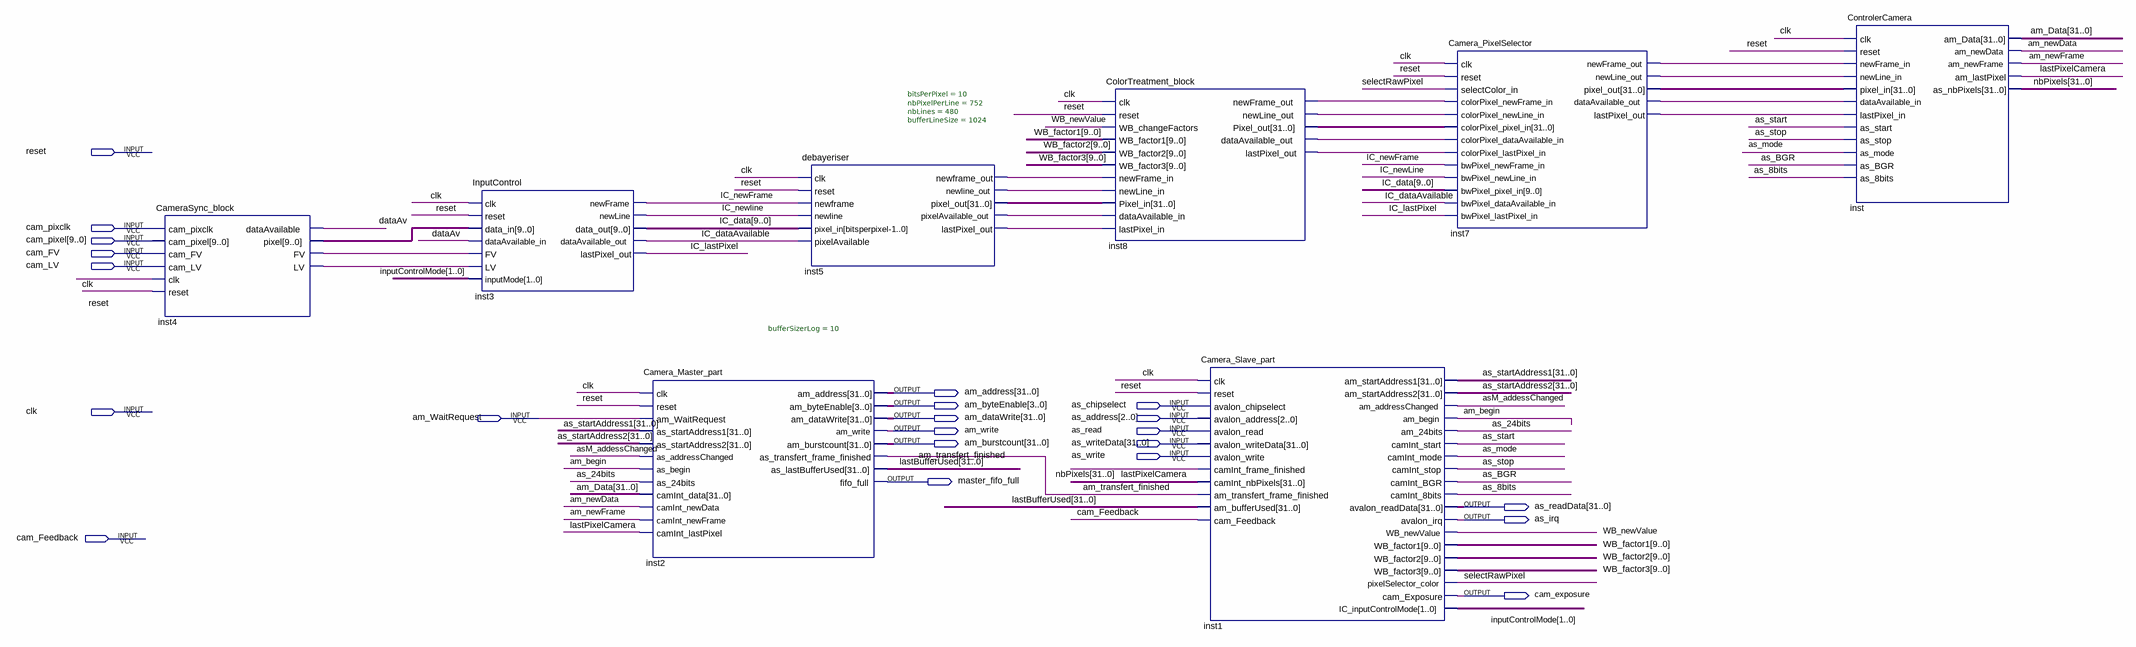
[diagram p0: schematic sheet]
// Quartus schematic Camera_Interface_block.bdf as structural Verilog: 8 symbols, 22 pins
module Camera_Interface_block (
  input  reset,
  input  cam_pixclk,
  input  [9:0] cam_pixel,
  input  cam_FV,
  input  cam_LV,
  input  as_chipselect,
  input  clk,
  input  am_WaitRequest,
  input  [2:0] as_address,
  input  as_read,
  input  [31:0] as_writeData,
  input  as_write,
  input  cam_Feedback,
  output [31:0] am_address,
  output [3:0] am_byteEnable,
  output [31:0] am_dataWrite,
  output am_write,
  output [31:0] am_burstcount,
  output master_fifo_full,
  output [31:0] as_readData,
  output as_irq,
  output cam_exposure
);

  wire am_begin, am_newData, am_newFrame, am_transfert_finished, as_8bits, as_24bits, as_BGR, as_mode,
       as_start, as_stop, asM_addessChanged, dataAv, IC_dataAvailable, IC_lastPixel, IC_newFrame, IC_newLine,
       inst4_fv, inst4_lv, inst5_lastpixel_out, inst5_newframe_out, inst5_newline_out,
       inst5_pixelavailable_out, inst7_dataavailable_out, inst7_lastpixel_out, inst7_newframe_out,
       inst7_newline_out, inst8_dataavailable_out, inst8_lastpixel_out, inst8_newframe_out,
       inst8_newline_out, lastPixelCamera, selectRawPixel, WB_newValue;
  wire [1:0] inputControlMode;
  wire [9:0] IC_data, inst4_pixel, WB_factor1, WB_factor2, WB_factor3;
  wire [31:0] am_Data, as_startAddress1, as_startAddress2, inst5_pixel_out, inst7_pixel_out, inst8_pixel_out,
       lastBufferUsed, nbPixels;

  CameraSync_block inst4 (
    .cam_pixclk(cam_pixclk), .cam_pixel(cam_pixel), .cam_FV(cam_FV), .cam_LV(cam_LV), .clk(clk),
    .reset(reset), .dataAvailable(dataAv), .pixel(inst4_pixel), .FV(inst4_fv), .LV(inst4_lv));
  InputControl inst3 (
    .clk(clk), .reset(reset), .data_in(inst4_pixel), .dataAvailable_in(dataAv), .FV(inst4_fv), .LV(inst4_lv),
    .inputMode(inputControlMode), .newFrame(IC_newFrame), .newLine(IC_newLine), .data_out(IC_data),
    .dataAvailable_out(IC_dataAvailable), .lastPixel_out(IC_lastPixel));
  Camera_Master_part #(.bufferSizerLog(10)) inst2 (
    .clk(clk), .reset(reset), .am_WaitRequest(am_WaitRequest), .as_startAddress1(as_startAddress1),
    .as_startAddress2(as_startAddress2), .as_addressChanged(asM_addessChanged), .as_begin(am_begin),
    .as_24bits(as_24bits), .camInt_data(am_Data), .camInt_newData(am_newData), .camInt_newFrame(am_newFrame),
    .camInt_lastPixel(lastPixelCamera), .am_address(am_address), .am_byteEnable(am_byteEnable),
    .am_dataWrite(am_dataWrite), .am_write(am_write), .am_burstcount(am_burstcount),
    .as_transfert_frame_finished(am_transfert_finished), .as_lastBufferUsed(lastBufferUsed),
    .fifo_full(master_fifo_full));
  debayeriser #(.bitsPerPixel(10), .nbPixelPerLine(752), .nbLines(480), .bufferLineSize(1024)) inst5 (
    .clk(clk), .reset(reset), .newframe(IC_newFrame), .newline(IC_newLine), .pixel_in(IC_data),
    .pixelAvailable(IC_dataAvailable), .newframe_out(inst5_newframe_out), .newline_out(inst5_newline_out),
    .pixel_out(inst5_pixel_out), .pixelAvailable_out(inst5_pixelavailable_out),
    .lastPixel_out(inst5_lastpixel_out));
  ColorTreatment_block inst8 (
    .clk(clk), .reset(reset), .WB_changeFactors(WB_newValue), .WB_factor1(WB_factor1),
    .WB_factor2(WB_factor2), .WB_factor3(WB_factor3), .newFrame_in(inst5_newframe_out),
    .newLine_in(inst5_newline_out), .Pixel_in(inst5_pixel_out), .dataAvailable_in(inst5_pixelavailable_out),
    .lastPixel_in(inst5_lastpixel_out), .newFrame_out(inst8_newframe_out), .newLine_out(inst8_newline_out),
    .Pixel_out(inst8_pixel_out), .dataAvailable_out(inst8_dataavailable_out),
    .lastPixel_out(inst8_lastpixel_out));
  Camera_Slave_part inst1 (
    .clk(clk), .reset(reset), .avalon_chipselect(as_chipselect), .avalon_address(as_address),
    .avalon_read(as_read), .avalon_writeData(as_writeData), .avalon_write(as_write),
    .camInt_frame_finished(lastPixelCamera), .camInt_nbPixels(nbPixels),
    .am_transfert_frame_finished(am_transfert_finished), .am_bufferUsed(lastBufferUsed),
    .cam_Feedback(cam_Feedback), .am_startAddress1(as_startAddress1), .am_startAddress2(as_startAddress2),
    .am_addressChanged(asM_addessChanged), .am_begin(am_begin), .am_24bits(as_24bits),
    .camInt_start(as_start), .camInt_mode(as_mode), .camInt_stop(as_stop), .camInt_BGR(as_BGR),
    .camInt_8bits(as_8bits), .avalon_readData(as_readData), .avalon_irq(as_irq), .WB_newValue(WB_newValue),
    .WB_factor1(WB_factor1), .WB_factor2(WB_factor2), .WB_factor3(WB_factor3),
    .pixelSelector_color(selectRawPixel), .cam_Exposure(cam_exposure), .IC_inputControlMode(inputControlMode));
  Camera_PixelSelector inst7 (
    .clk(clk), .reset(reset), .selectColor_in(selectRawPixel), .colorPixel_newFrame_in(inst8_newframe_out),
    .colorPixel_newLine_in(inst8_newline_out), .colorPixel_pixel_in(inst8_pixel_out),
    .colorPixel_dataAvailable_in(inst8_dataavailable_out), .colorPixel_lastPixel_in(inst8_lastpixel_out),
    .bwPixel_newFrame_in(IC_newFrame), .bwPixel_newLine_in(IC_newLine), .bwPixel_pixel_in(IC_data),
    .bwPixel_dataAvailable_in(IC_dataAvailable), .bwPixel_lastPixel_in(IC_lastPixel),
    .newFrame_out(inst7_newframe_out), .newLine_out(inst7_newline_out), .pixel_out(inst7_pixel_out),
    .dataAvailable_out(inst7_dataavailable_out), .lastPixel_out(inst7_lastpixel_out));
  ControlerCamera inst (
    .clk(clk), .reset(reset), .newFrame_in(inst7_newframe_out), .newLine_in(inst7_newline_out),
    .pixel_in(inst7_pixel_out), .dataAvailable_in(inst7_dataavailable_out),
    .lastPixel_in(inst7_lastpixel_out), .as_start(as_start), .as_stop(as_stop), .as_mode(as_mode),
    .as_BGR(as_BGR), .as_8bits(as_8bits), .am_Data(am_Data), .am_newData(am_newData),
    .am_newFrame(am_newFrame), .am_lastPixel(lastPixelCamera), .as_nbPixels(nbPixels));
endmodule
